# Altium schematic sheet 5V_AUX.SchDoc
size A4; SheetNumber: 6; SheetTotal: 8
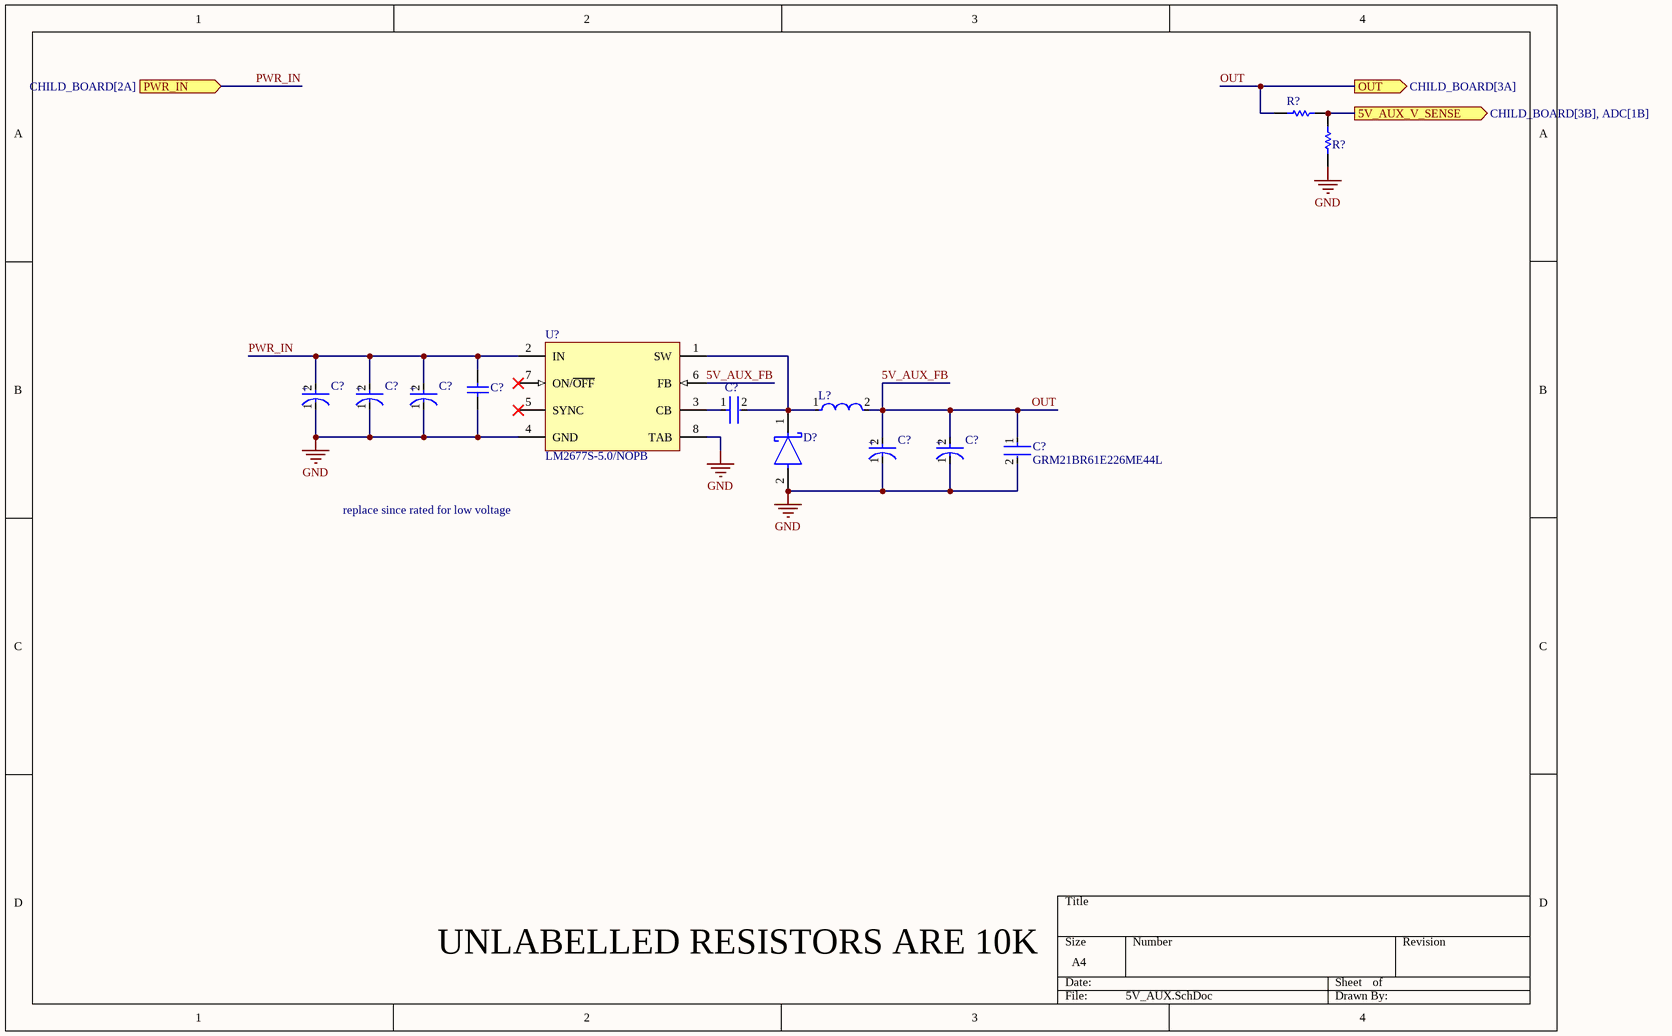
[diagram p0: 5V_AUX.SchDoc]

## Parts
(Parts that share a designator on the sheet are numbered #1, #2 ... from top to bottom, then left to right.)
C?#1  T491B156K025AT  [FP-POSCAP-B2-MFG]  (value not drawn)
C?#2  T491B156K025AT  [FP-POSCAP-B2-MFG]  (value not drawn)
C?#3  T491B156K025AT  [FP-POSCAP-B2-MFG]  (value not drawn)
C?#4  CAP 470nF 50V 1812(4532)  [CAPC1812(4532)125_M]  (value not drawn)
C?#5  C0805C103J5RACTU  [FP-C0805C-DN-MFG]  (value not drawn)
C?#6  16SVPF180M  [FP-OS-CON-SMT-C6-MFG]  (value not drawn)
C?#7  16SVPF180M  [FP-OS-CON-SMT-C6-MFG]  (value not drawn)
C?#8  GRM21BR61E226ME44L  [FP-GRM21B-0_2-e0_2_0_7-IPC_B]
D?  B540C-13-F  [FP-SMC-MFG]  (value not drawn)
L?  IHLP4040DZER220M11  [FP-IHLP-4040DZ-FP_3_124x3-MFG]  (value not drawn)
R?#1  ERJ3EKF1002V  [RESC1609X55X30LL15T15]  (value not drawn)
R?#2  ERJ3EKF1002V  [RESC1609X55X30LL15T15]  (value not drawn)
U?  LM2677S-5.0/NOPB  [KTW0007B_N]

## Ports
5V_AUX_V_SENSE (out, see CHILD_BOARD[3B], ADC[1B]), OUT (out, see CHILD_BOARD[3A]), PWR_IN (in, see CHILD_BOARD[2A])

## Nets
GND: C?#1.1(C) C?#2.1(C) C?#3.1(C) C?#4.1 C?#6.1(C) C?#7.1(C) C?#8.2 D?.2(A) R?#2.1 U?.4(GND) U?.8(TAB)
5V_AUX_FB: C?#6.2(A) C?#7.2(A) C?#8.1 L?.2 R?#1.1 U?.6(FB) ; port OUT  [also labelled OUT]
5V_AUX_V_SENSE: R?#1.2 R?#2.2 ; port 5V_AUX_V_SENSE
PWR_IN: C?#1.2(A) C?#2.2(A) C?#3.2(A) C?#4.2 U?.2(IN) ; port PWR_IN
NetC?#5_1: C?#5.1 U?.3(CB)
NetC?#5_2: C?#5.2 D?.1(C) L?.1 U?.1(SW)

Not connected (* = marked no-connect by the designer): U? 5(SYNC)* 7(ON/~{OFF})*

## Notes on the sheet
- replace since rated for low voltage
- UNLABELLED RESISTORS ARE 10K
- (in symbol CMP-05428-001076-1) +
- (in symbol CMP-05428-001090-1) +

## Library data of the parts
C?#1-C?#3 = CMP-05428-001076-1: USE T491B156K025AT / Molded Tantalum Polymer Capacitor 15uF 20% 16V life 2000Hours SMD 1411; Dissipation Factor: 10%; Ripple Current: 1A; Leakage Current: 72uA; ESR (Equivalent Series Resistance): 90mR; Polarity: Polar; Height: 1.9mm; Height - Seated (Max): 0.079inch; Min Operating Temperature: -55°C; Case Code (Imperial): 1210; Package Quantity: 2000; Mount: Surface Mount; RoHS Compliant: Yes; Voltage Rating: 16V; Packaging: Tape and Reel; Number of Pins: 2; Features: General Purpose; Depth: 2.8mm; Case/Package: 1411; Case Code (Metric): 3528; Length: 3.5mm; Termination: SMD/SMT; Lead Free: Lead Free; Life (Hours): 2000Hour; Series: POSCAP™ TQC; Radiation Hardening: No; Voltage Rating (DC): 16V; Voltage: 16V; Capacitance: 15uF; REACH SVHC: No SVHC; Construction: Flat; Tolerance: 20%; Width: 2.8mm; Max Operating Temperature: 105°C
C?#4 = CMP-1040-01539-1: CAP 470nF 50V ±10% 1812 (4532 Metric) Thickness 1.25mm SMD; Tolerance: Â±10%; Case-Metric: 4532; Case-EIA: 1812; Technology: SMT; Max Thickness: 1.25 mm; Value: 470nF; Rated Voltage: 50 V
C?#5 = CMP-2007-00254-2: CAP CER 10000PF 50V X7R 0805; Manufacturer: KEMET; Value: 10,000 pF; Material: Ceramic; Temperature Coefficient: 30ppm/°C; Tolerance: 0.05; Device Class L1: Passive Components; Temperature: -55°C to +125°C; Lead Free: Yes; ComponentLink2URL: https://content.kemet.com/datasheets/KEM_C1003_C0G_SMD.pdf; Device Class L3: Ceramic Capacitors; Temperature Characteristic: X7R; Temperature Range High: +125°C; Mouser Description: Capacitor; Ceramic; Cap 0.01uF; Tol 5%; Vol-Rtg 50 V; SMT; Case 0805; X7R; TR; ComponentLink2Description: Datasheet; Manufacturer Part Number: C0805C103J5RACTU; Height: 0.88mm; Digikey Description: CAP CER 10000PF 50V X7R 0805; Capacitance: 10,000 pF; Temperature Range Low: -55°C; Device Class L2: Capacitors; Octopart: https://octopart.com/c0805c103j5ractu-kemet-133473; Voltage Rating: 50 V; Category: Cap; RoHS: TRUE; Automotive: No; Package: C0805C-DN; Ipc Land Pattern Name: CAPC200125X78
C?#6 C?#7 = CMP-05428-001090-1: Conductive Polymer Aluminum Solid Capacitors (OS-CON) 180uF ±20% 16V; Polarity: Polar; Dissipation Factor: 12%; Ripple Current: 3.3A; ESR (Equivalent Series Resistance): 22mR; Leakage Current: 576uA; Life (Hours): 5000Hour; Min Operating Temperature: -55°C; REACH SVHC: No SVHC; Height: 5.9mm; Case/Package: Radial; Packaging: Tape and Reel; Termination: SMD/SMT; Max Operating Temperature: 105°C; Capacitance: 180uF; Package Quantity: 1; RoHS Compliant: Yes; Number of Pins: 6; Tolerance: 20%; Lead Free: Lead Free; Mount: Surface Mount; Voltage Rating: 16V; Length: 5.9mm; Height - Seated (Max): 0.236inch; Voltage Rating (DC): 16V; Radiation Hardening: No; Voltage: 16V; Diameter: 6.3mm; Series: OS-CON™, SVPF; Ripple Current (AC): 3.3A; Construction: Cylindrical
C?#8 = CMP-2007-03222-3: Chip Multilayer Ceramic Capacitors for General Purpose, 0805, 22uF, X5R, 15%, 20%, 25V; Case/Package: 0805; Depth: 1.25mm; Resistor Type: Ceramic; Voltage Rating: 25V; Lead Free: Lead Free; Voltage Rating (DC): 25V; Case Code (Metric): 2012; Thickness: 0.057inch; REACH SVHC: No SVHC; Material: Ceramic; Tolerance: 20%; Length: 2mm; Capacitance: 22uF; Case Code (Imperial): 0805; Max Operating Temperature: 85°C; Termination: SMD/SMT; Weight: 0.000335oz; Dielectric: X5R; Packaging: Tape and Reel; Voltage: 25V; Package Quantity: 3000; Height: 1.25mm; Mount: Surface Mount; Width: 1.25mm; Min Operating Temperature: -55°C
D? = CMP-2000-05097-3: DIODE SCHOTTKY 40V 5A SMC; Manufacturer: Diodes Inc.; Automotive Grade: NA; Peak Reverse Current: 0.5mA; Value: 300pF; Max Junction Temp: +150°C; Max Surge Forward Current: 100A; Standoff Height: 0.1mm; Digikey Description: DIODE SCHOTTKY 40V 5A SMC; Temperature Range Low: -55°C; Manufacturer Part Number: B540C-13-F; Octopart: https://octopart.com/b540c-13-f-diodes+inc.-325873; Lead Free: Yes; Reverse Voltage: 40V; RoHS: TRUE; Category: Diode; Mouser Description: Diode: Schottky rectifying; SMD; 40V; 5A; SMC; Package: reel, tape; ComponentLink2Description: Datasheet; Temperature Range High: +150°C; Automotive: No; Footprint Url: https://www.diodes.com/assets/Package-Files/SMC.pdf; Device Class L3: Schottky Diodes; Height: 2.5mm; Forward Current: 5A; Temperature: -55°C to +150°C; Package: SMC; ComponentLink2URL: https://www.diodes.com/assets/Datasheets/ds13012.pdf; Device Class L2: Diodes; Max Repetitive Reverse Voltage: 40V; Device Class L1: Discrete Semiconductors; Capacitance: 300pF
L? = CMP-02424-000785-1: Commercial Inductors, Low DCR Series 22uH 5A 66mΩ 20%; Shielding: Shielded; Max DC Current: 4.5A; Test Frequency: 100kHz; DC Resistance (DCR): 66mR; Self Resonant Frequency: 1MHz; Core Material: Metal; Series: IHLP-4040DZ-11; Min Operating Temperature: -55°C; Rated Current-Max: 5A; Current Rating: 5A; Military Standard: Not; Depth: 10.3mm; Height - Seated (Max): 0.157inch; Contact Plating: Tin; Termination: SMD/SMT; Length: 0.43inch; Package Quantity: 1; Width: 0.405inch; Inductance Tolerance: 20%; Tolerance: 20%; Height: 4mm; RMS Current (Irms): 5A; Saturation Current: 4.5A; Inductance: 22uH; Mount: Surface Mount; Max Operating Temperature: 125°C; Case/Package: 4040; Packaging: Tape and Reel; Radiation Hardening: No; RoHS Compliant: Yes; Lead Free: Lead Free
R?#1 R?#2 = CMP-1012-00623-3: Chip Resistor, 10 KOhm, +/- 1%, 0.1 W, -55 to 155 degC, 0603 (1608 Metric), RoHS, Tape and Reel; Manufacturer: Panasonic; Voltage Rating: 75V; Case\/Package: 0603; Power Rating: 100mW; Resistance: 10KOhm; Temperature Coefficient: 100ppm\/degreesC; Number of Pins: 2; Package Reference: 603; Depth: 0.8mm; Mount: SurfaceMount; Package Description: 2-Pin Surface Mount Device, Body 1.6 x 0.85 mm; Datasheet Version: 02/2017; Length: 1.6mm; Lead Free: LeadFree; Height: 0.45mm; Number of Terminations: 2; Max Power Dissipation: 100mW; Min Operating Temperature: -55degC; Datasheet URL: https://industrial.panasonic.com/cdbs/www-data/pdf/RDA0000/AOA0000C304.pdf; Termination: SMD/SMT; Case Code (Metric): 1608; Case Code (Imperial): 0603; Tolerance: 1%; Max Operating Temperature: 155degC; RoHSCompliant: true; Voltage Rating (DC): 75V; Radiation Hardening: No; Packaging: TapeandReel; Composition: ThickFilm; Mounting Technology: SurfaceMount; Manufacturer URL: http://www.panasonic.com/; Width: 0.031inch; REACH SVHC: NoSVHC; Contact Plating: Tin; Military Standard: Not; Package Quantity: 1
U? = CMP-0069-00212-3: SIMPLE SWITCHER® High Efficiency 5A Step-Down Voltage Regulator with Sync, 7-pin TO-263, Pb-Free; Manufacturer: Texas Instruments; PackageTopMarking: NSUZXYTTE#*LM2677S*-5.0; PowerWise: N; Code_JEDEC: MO-169-AC; ComponentLink1URL: http://www.ti.com/general/docs/lit/getliterature.tsp?genericPartNumber=LM2677&fileType=pdf; PackageReference: KTW0007B; PinCount: 7; RoHS: Y; PackageDescription: TO-263, Molded, .400 x .390 x .180in Body, 7 Lead, .050in Pitch, Surface Mount; ComponentLink1Description: Datasheet URL; CompType: Switcher